# Altium schematic sheet FPGAPowerConfig.SchDoc
size A
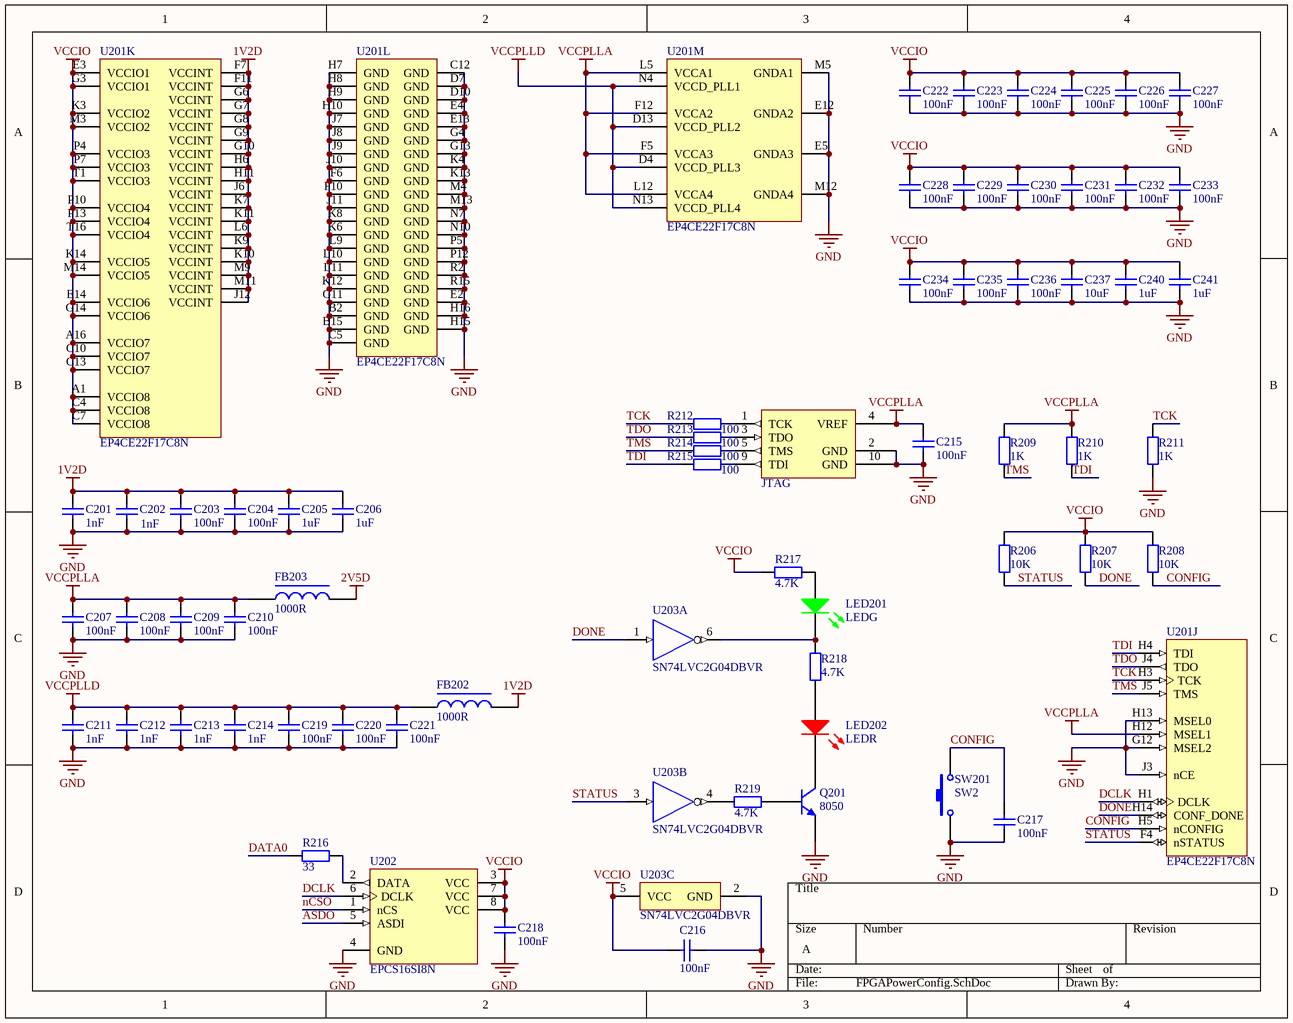
[diagram p0: FPGAPowerConfig.SchDoc]

## Parts
C201  value 1nF  [0402C]  (hidden comment: MLCC)
C202  value 1nF  [0402C]  (hidden comment: MLCC)
C203  value 100nF  [0402C]  (hidden comment: MLCC)
C204  value 100nF  [0402C]  (hidden comment: MLCC)
C205  value 1uF  [0603C]  (hidden comment: MLCC)
C206  value 1uF  [0603C]  (hidden comment: MLCC)
C207  value 100nF  [0402C]  (hidden comment: MLCC)
C208  value 100nF  [0402C]  (hidden comment: MLCC)
C209  value 100nF  [0402C]  (hidden comment: MLCC)
C210  value 100nF  [0402C]  (hidden comment: MLCC)
C211  value 1nF  [0402C]  (hidden comment: MLCC)
C212  value 1nF  [0402C]  (hidden comment: MLCC)
C213  value 1nF  [0402C]  (hidden comment: MLCC)
C214  value 1nF  [0402C]  (hidden comment: MLCC)
C215  value 100nF  [0603C]  (hidden comment: MLCC)
C216  value 100nF  [0603C]  (hidden comment: MLCC)
C217  value 100nF  [0603C]  (hidden comment: MLCC)
C218  value 100nF  [0603C]  (hidden comment: MLCC)
C219  value 100nF  [0402C]  (hidden comment: MLCC)
C220  value 100nF  [0402C]  (hidden comment: MLCC)
C221  value 100nF  [0402C]  (hidden comment: MLCC)
C222  value 100nF  [0402C]  (hidden comment: MLCC)
C223  value 100nF  [0402C]  (hidden comment: MLCC)
C224  value 100nF  [0402C]  (hidden comment: MLCC)
C225  value 100nF  [0402C]  (hidden comment: MLCC)
C226  value 100nF  [0402C]  (hidden comment: MLCC)
C227  value 100nF  [0402C]  (hidden comment: MLCC)
C228  value 100nF  [0402C]  (hidden comment: MLCC)
C229  value 100nF  [0402C]  (hidden comment: MLCC)
C230  value 100nF  [0402C]  (hidden comment: MLCC)
C231  value 100nF  [0402C]  (hidden comment: MLCC)
C232  value 100nF  [0402C]  (hidden comment: MLCC)
C233  value 100nF  [0402C]  (hidden comment: MLCC)
C234  value 100nF  [0402C]  (hidden comment: MLCC)
C235  value 100nF  [0402C]  (hidden comment: MLCC)
C236  value 100nF  [0402C]  (hidden comment: MLCC)
C237  value 10uF  [0805C]  (hidden comment: MLCC)
C240  value 1uF  [0603C]  (hidden comment: MLCC)
C241  value 1uF  [0603C]  (hidden comment: MLCC)
FB202  value 1000R  [0603L]  (hidden comment: FerriteBead)
FB203  value 1000R  [0603L]  (hidden comment: FerriteBead)
JTAG  JTAG_ALTERA  [JTAG10]  (value not drawn)
LED201  LEDG  [LED1206G]
LED202  LEDR  [LED1206R]
Q201  8050  [SOT-23]
R206  value 10K  [0603R]  (hidden comment: Resistor)
R207  value 10K  [0603R]  (hidden comment: Resistor)
R208  value 10K  [0603R]  (hidden comment: Resistor)
R209  value 1K  [0603R]  (hidden comment: Resistor)
R210  value 1K  [0603R]  (hidden comment: Resistor)
R211  value 1K  [0603R]  (hidden comment: Resistor)
R212  value 100  [0603R]  (hidden comment: Resistor)
R213  value 100  [0603R]  (hidden comment: Resistor)
R214  value 100  [0603R]  (hidden comment: Resistor)
R215  value 100  [0603R]  (hidden comment: Resistor)
R216  value 33  [0603R]  (hidden comment: Resistor)
R217  value 4.7K  [0603R]  (hidden comment: Resistor)
R218  value 4.7K  [0603R]  (hidden comment: Resistor)
R219  value 4.7K  [0603R]  (hidden comment: Resistor)
SW201  SW2  [SW-SMD1]
U201  EP4CE22F17C8N  [FBGA256_A-155]  (parts J,K,L,M of 13)
U202  EPCS16SI8N  [SOIC8_N]
U203  SN74LVC2G04DBVR  [DBV0006A_N]  (parts A,B,C of 3)

## Nets
1V2D: C201.2 C202.2 C203.2 C204.2 C205.2 C206.2 FB202.2 U201.F7(VCCINT) U201.F11(VCCINT) U201.G6(VCCINT) U201.G7(VCCINT) U201.G8(VCCINT) U201.G9(VCCINT) U201.G10(VCCINT) U201.H6(VCCINT) U201.H11(VCCINT) U201.J6(VCCINT) U201.J12(VCCINT) U201.K7(VCCINT) U201.K9(VCCINT) U201.K10(VCCINT) U201.K11(VCCINT) U201.L6(VCCINT) U201.M9(VCCINT) U201.M11(VCCINT)
2V5D: FB203.2
GND: C201.1 C202.1 C203.1 C204.1 C205.1 C206.1 C207.1 C208.1 C209.1 C210.1 C211.1 C212.1 C213.1 C214.1 C215.1 C216.2 C217.1 C218.1 C219.1 C220.1 C221.1 C222.1 C223.1 C224.1 C225.1 C226.1 C227.1 C228.1 C229.1 C230.1 C231.1 C232.1 C233.1 C234.1 C235.1 C236.1 C237.1 C240.1 C241.1 JTAG.2(GND) JTAG.10(GND) Q201.2(E) R211.1 SW201.1 U201.B2(GND) U201.B15(GND) U201.C5(GND) U201.C12(GND) U201.D7(GND) U201.D10(GND) U201.E2(GND) U201.E4(GND) U201.E5(GNDA3) U201.E12(GNDA2) U201.E13(GND) U201.F6(GND) U201.F10(GND) U201.G4(GND) U201.G11(GND) U201.G12(MSEL2) U201.G13(GND) U201.H7(GND) U201.H8(GND) U201.H9(GND) U201.H10(GND) U201.H13(MSEL0) U201.H15(GND) U201.H16(GND) U201.J3(nCE) U201.J7(GND) U201.J8(GND) U201.J9(GND) U201.J10(GND) U201.J11(GND) U201.K4(GND) U201.K6(GND) U201.K8(GND) U201.K12(GND) U201.K13(GND) U201.L9(GND) U201.L10(GND) U201.L11(GND) U201.M4(GND) U201.M5(GNDA1) U201.M12(GNDA4) U201.M13(GND) U201.N7(GND) U201.N10(GND) U201.P5(GND) U201.P12(GND) U201.R2(GND) U201.R15(GND) U202.4(GND) U203.2(GND)
VCCIO: C216.1 C218.2 C222.2 C223.2 C224.2 C225.2 C226.2 C227.2 C228.2 C229.2 C230.2 C231.2 C232.2 C233.2 C234.2 C235.2 C236.2 C237.2 C240.2 C241.2 R206.2 R207.2 R208.2 R217.1 U201.A1(VCCIO8) U201.A16(VCCIO7) U201.C4(VCCIO8) U201.C7(VCCIO8) U201.C10(VCCIO7) U201.C13(VCCIO7) U201.E3(VCCIO1) U201.E14(VCCIO6) U201.G3(VCCIO1) U201.G14(VCCIO6) U201.K3(VCCIO2) U201.K14(VCCIO5) U201.M3(VCCIO2) U201.M14(VCCIO5) U201.P4(VCCIO3) U201.P7(VCCIO3) U201.P10(VCCIO4) U201.P13(VCCIO4) U201.T1(VCCIO3) U201.T16(VCCIO4) U202.3(VCC) U202.7(VCC) U202.8(VCC) U203.5(VCC)
VCCPLLA: C207.2 C208.2 C209.2 C210.2 C215.2 FB203.1 JTAG.4(VREF) R209.2 R210.2 U201.F5(VCCA3) U201.F12(VCCA2) U201.H12(MSEL1) U201.L5(VCCA1) U201.L12(VCCA4)
VCCPLLD: C211.2 C212.2 C213.2 C214.2 C219.2 C220.2 C221.2 FB202.1 U201.D4(VCCD_PLL3) U201.D13(VCCD_PLL2) U201.N4(VCCD_PLL1) U201.N13(VCCD_PLL4)
ASDO: U202.5(ASDI)
CONFIG: C217.2 R208.1 SW201.2 U201.H5(nCONFIG)
DATA0: R216.1
DCLK: U201.H1(DCLK) U202.6(DCLK)
DONE: R207.1 U201.H14(CONF_DONE) U203.1(1A)
nCSO: U202.1(nCS)
STATUS: R206.1 U201.F4(nSTATUS) U203.3(2A)
TCK: R211.2 R212.1 U201.H3(TCK)
TDI: R210.1 R215.1 U201.H4(TDI)
TDO: R213.1 U201.J4(TDO)
TMS: R209.1 R214.1 U201.J5(TMS)
NetJTAG_1: JTAG.1(TCK) R212.2
NetJTAG_3: JTAG.3(TDO) R213.2
NetJTAG_5: JTAG.5(TMS) R214.2
NetJTAG_9: JTAG.9(TDI) R215.2
NetLED201_1: LED201.1(A) R217.2
NetLED201_2: LED201.2(K) R218.2 U203.6(1Y)
NetLED202_1: LED202.1(A) R218.1
NetLED202_2: LED202.2(K) Q201.3(C)
NetQ201_1: Q201.1(B) R219.2
NetR216_2: R216.2 U202.2(DATA)
NetR219_1: R219.1 U203.4(2Y)

## Library data of the parts
JTAG = JTAG_ALTERA: ALTERA JTAG port
LED201 = LEDG: GREEN LED
LED202 = LEDR: RED LED
Q201 = 8050: NPN Bipolar Transistor
SW201 = SW2: Switch
U201 = EP4CE22F17C8N: Cyclone IV Family FPGA, 1.2V Core, 153 I/O Pins, 4 PLLs, 256-Pin FBGA, Speed Grade 8, Commercial Grade, Pb-Free; Manufacturer: Altera; DatasheetVersion: ver1.6, Nov-2011; PackageVersion: ver2.0, Nov-2011; PackageReference: FBGA256_A-155; PackageDescription: 256-Pin FineLine Ball-Grid Array (FBGA) - Thin - Wire Bond - A:1.55; Code_JEDEC: MO-192-DAF-1; ComponentLink1Description: Manufacturer URL; ComponentLink1URL: http://www.altera.com/; ComponentLink2Description: Handbook; ComponentLink2URL: http://www.altera.com/literature/hb/cyclone-iv/cyclone4-handbook.pdf; ComponentLink3Description: Pinout; ComponentLink3URL: http://www.altera.com/literature/lit-dp.jsp?category=cyc%204&showspreadsheet=y; ComponentLink4Description: Package Specification; ComponentLink4URL: http://www.altera.com/devicepackaging/04R00230-03.pdf
U202 = EPCS16SI8N: EPCS16 Series, In-system programmable 3.3V serial configuration device, 8-Pin SOIC, 16-Megabit, Industrial Grade, Pb-Free; Configures: All Arria series, all Cyclone series and all Stratix series (except Stratix); DatasheetVersion: ver3.0, Dec-2009; PackageVersion: ver14.2, Oct-2005; PackageReference: SOIC8; PackageDescription: 8-Pin Small Outline Integrated Circuit Package (SOIC8); Code_JEDEC: MS-012-AA; Code_IPC: SOIC127P600-8; ComponentLink1Description: Manufacturer URL; ComponentLink1URL: http://www.altera.com/; ComponentLink2Description: Configuration Handbook; ComponentLink2URL: http://www.altera.com/literature/hb/cfg/config_handbook.pdf; ComponentLink3Description: Pinout; ComponentLink3URL: http://www.altera.com/literature/hb/cfg/config_handbook.pdf; ComponentLink4Description: Package Specification; ComponentLink4URL: http://www.altera.com/support/devices/packaging/specifications/pkg-pin/pdf/016-SOIC.pdf
U203 = SN74LVC2G04DBVR: Dual Inverter, DBV0006A, LARGE T&R; Manufacturer: Texas Instruments; VCC(Min)(V): 1.65; VCC(Max)(V): 5.5; Output Type: CMOS; ICC @ Nom Voltage(Max)(mA): 0.01; Input Type: CMOS/TTL; Bits(#): 2; F @ Nom Voltage(Max)(Mhz): 150; Rating: Catalog; Technology Family: LVC; Voltage(Nom)(V): 1.8,2.5,3.3,5; Schmitt Trigger: No; Output Drive (IOL/IOH)(Max)(mA): 32/-32; tpd @ Nom Voltage(Max)(ns): 8,4.9,4.6,3.7; Logic: Inverting; Sub-Family: Inverting Buffer/Driver; DatasheetVersion: SCES195M; PackageReference: DBV0006A; Supplier 1: Mouser; Supplier Part Number 1: 595-SN74LVC2G04DBVR; Supplier 2: Digi-Key; Supplier Part Number 2: 296-13261-2-ND; Supplier 3: Digi-Key; Supplier Part Number 3: 296-13261-1-ND; Supplier 4: Digi-Key; Supplier Part Number 4: 296-13261-6-ND; Generic Part Number: SN74LVC2G04; Operating Temperature Range(C): -40 to 125; 3-State Output: No; PartNumber: SN74LVC2G04DBVR; ComponentLink1Description: Manufacturer URL; ComponentLink1URL: http://www.ti.com/; ComponentLink2Description: Datasheet; ComponentLink2URL: http://www.ti.com/lit/ds/symlink/sn74lvc2g04.pdf